# EAGLE design tally_box (EAGLE 6.6.0)
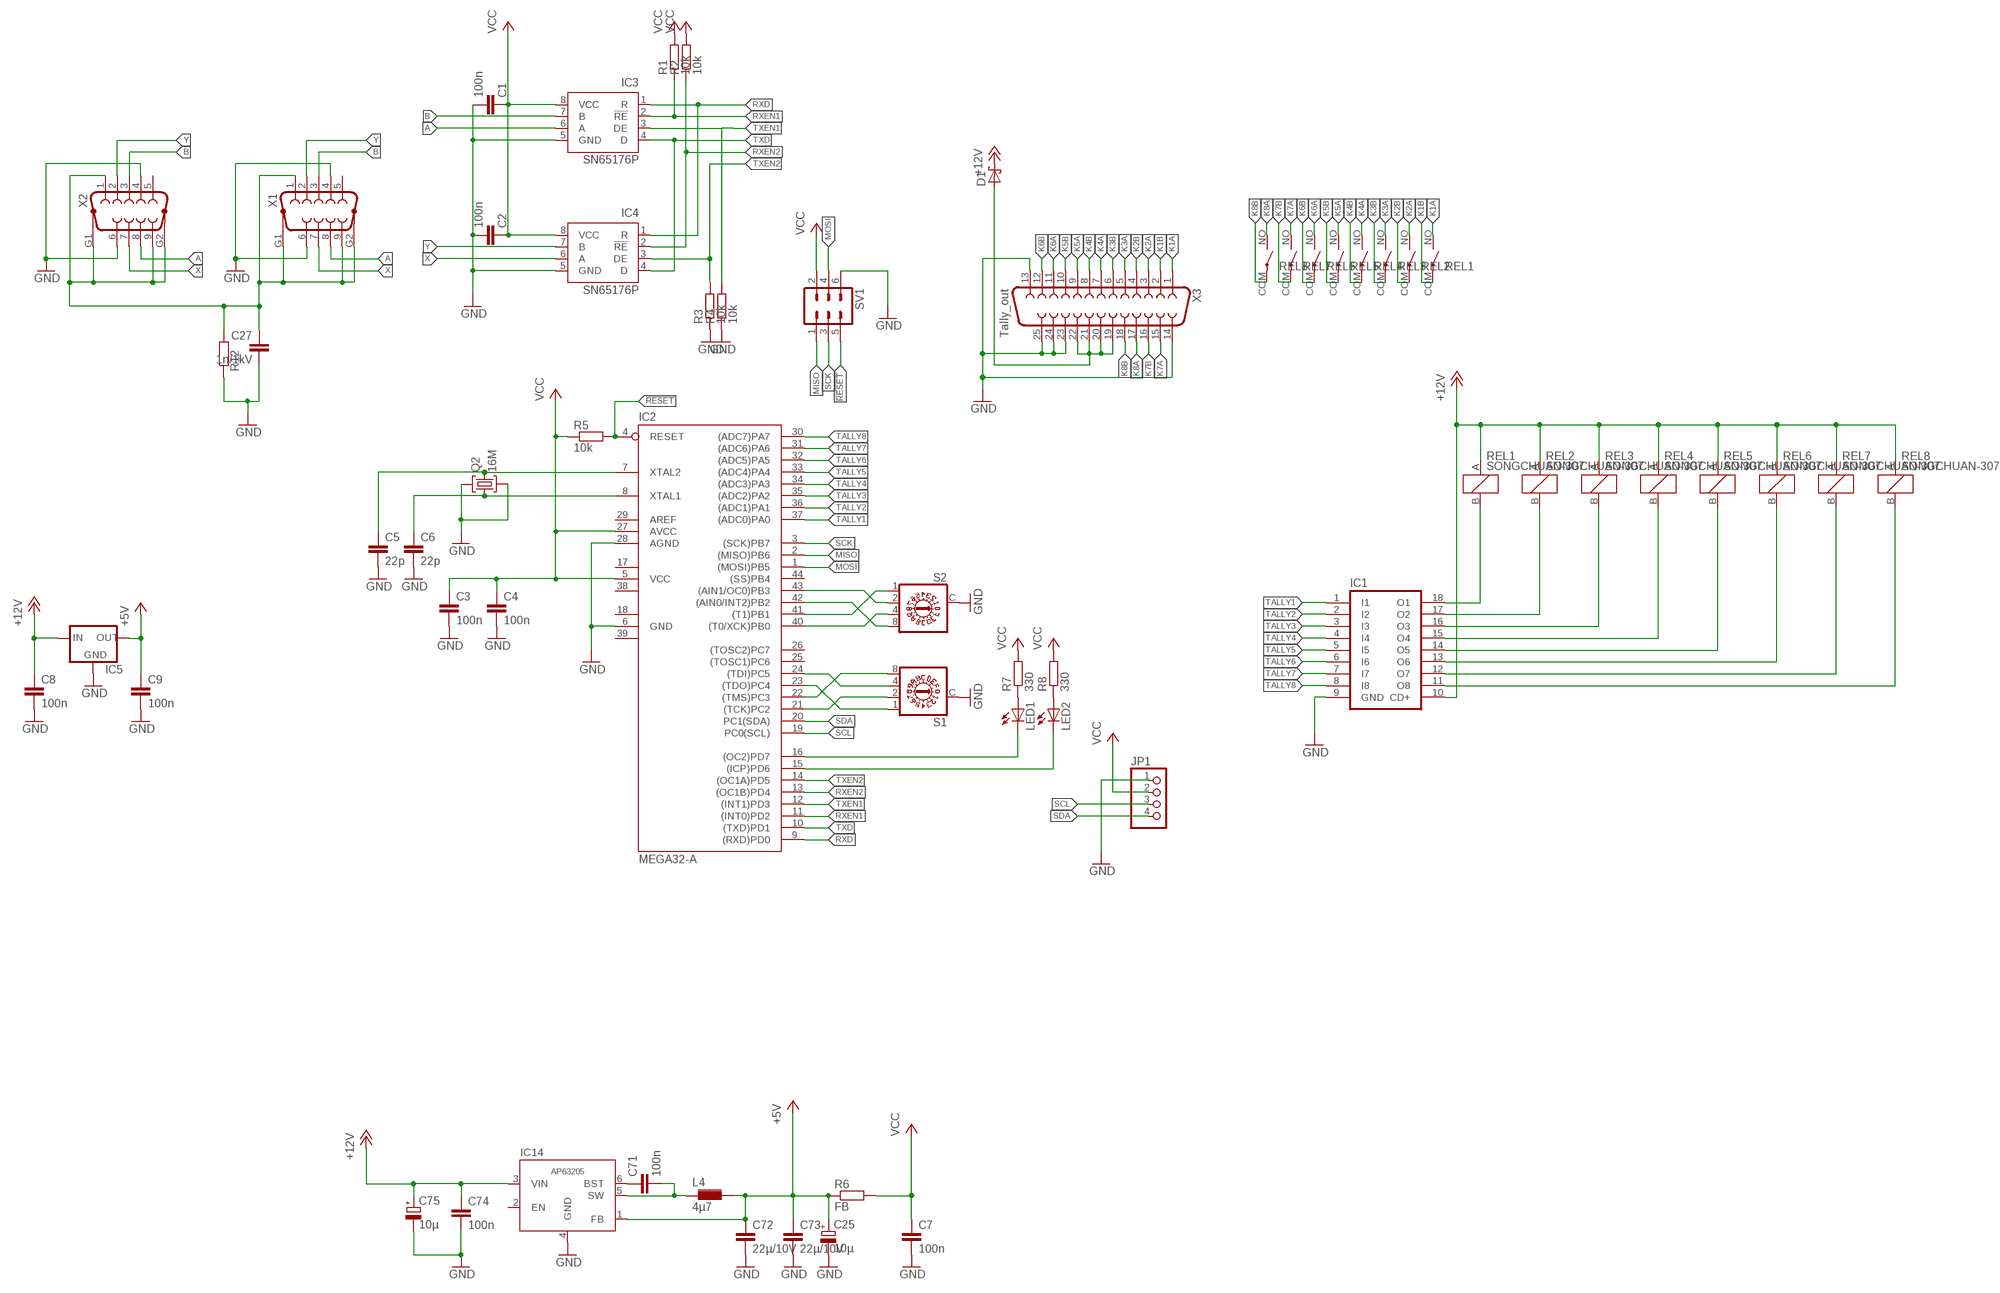
[diagram p0: schematic, sheet 1]

## Parts
C1  100n  C-EUC0603  [C0603]
C2  100n  C-EUC0603  [C0603]
C3  100n  C-EUC0603  [C0603]
C4  100n  C-EUC0603  [C0603]
C5  22p  C-EUC0603  [C0603]
C6  22p  C-EUC0603  [C0603]
C7  100n  C-EUC0603  [C0603]
C8  100n  C-EUC0805  [C0805]
C9  100n  C-EUC0805  [C0805]
C25  10µ  CPOL-EUC  [PANASONIC_C]
C27  1n/1kV  C-EUC1206  [C1206]
C71  100n  C-EUC0805  [C0805]
C72  22µ/10V  C-EUC0805  [C0805]
C73  22µ/10V  C-EUC0805  [C0805]
C74  100n  C-EUC0805  [C0805]
C75  10µ  CPOL-EUD  [PANASONIC_D]
D1  SCHOTTKY-DIODESMD  [SMB]
IC1  ULN2803A  [DIL18]
IC2  MEGA32-A  [TQFP44]
IC3  SN65176P  [DIL08]
IC4  SN65176P  [DIL08]
IC5  78XXS  [78XXS]
IC14  AP63205  AP6320X  [SOT23-6L]
JP1  PINHD-1X4  [1X04]
L4  4µ7  L-TYA4020  [TYA4020]
LED1  LED-TOPLED  [P-LCC-2]
LED2  LED-TOPLED  [P-LCC-2]
Q2  16M  CRYSTAL_SHIELDEDMJ  [MJ]
R1  10k  R-EU_R0603  [R0603]
R2  10k  R-EU_R0603  [R0603]
R3  10k  R-EU_R0603  [R0603]
R4  10k  R-EU_R0603  [R0603]
R5  10k  R-EU_R0603  [R0603]
R6  FB  R-EU_R0805  [R0805]
R7  330  R-EU_R0603  [R0603]
R8  330  R-EU_R0603  [R0603]
R12  R-EU_R0603  [R0603]
REL1  SONGCHUAN-307  [SONCHUAN-307]
REL2  SONGCHUAN-307  [SONCHUAN-307]
REL3  SONGCHUAN-307  [SONCHUAN-307]
REL4  SONGCHUAN-307  [SONCHUAN-307]
REL5  SONGCHUAN-307  [SONCHUAN-307]
REL6  SONGCHUAN-307  [SONCHUAN-307]
REL7  SONGCHUAN-307  [SONCHUAN-307]
REL8  SONGCHUAN-307  [SONCHUAN-307]
S1  A1353HEX  [A1353HEX]
S2  A1353HEX  [A1353HEX]
SV1  ML6  [ML6]
X1  F09HP  [F09HP]
X2  F09HP  [F09HP]
X3  Tally_out  F25HP  [F25HP]

## Nets
!RESET!: IC2.4(RESET) R5.2 SV1.5
+5V: C9.1 C25.+ C72.1 C73.1 IC5.OUT IC14.1(FB) L4.2 R6.1
+12V: C8.1 C74.1 C75.+ D1.C IC1.10(CD+) IC5.IN IC14.3(VIN) REL1.A(+) REL2.A(+) REL3.A(+) REL4.A(+) REL5.A(+) REL6.A(+) REL7.A(+) REL8.A(+)
A: IC3.6(A) X1.8 X2.8
B: IC3.7(B) X1.3 X2.3
GND: C1.2 C2.2 C3.2 C4.2 C5.2 C6.2 C7.2 C8.2 C9.2 C25.- C27.2 C72.2 C73.2 C74.2 C75.- IC1.9(GND) IC2.6(GND) IC2.28(AGND) IC3.5(GND) IC4.5(GND) IC5.GND IC14.4(GND) JP1.1 Q2.2(G1) Q2.4(G2) R3.1 R4.1 R12.1 S1.C S2.C SV1.6 X1.4 X1.6 X2.4 X2.6 X3.13 X3.14 X3.23 X3.24 X3.25
K1A: REL1.NO(S) X3.1
K1B: REL1.COM(P) X3.2
K2A: REL2.NO(S) X3.3
K2B: REL2.COM(P) X3.4
K3A: REL3.NO(S) X3.5
K3B: REL3.COM(P) X3.6
K4A: REL4.NO(S) X3.7
K4B: REL4.COM(P) X3.8
K5A: REL5.NO(S) X3.9
K5B: REL5.COM(P) X3.10
K6A: REL6.NO(S) X3.11
K6B: REL6.COM(P) X3.12
K7A: REL7.NO(S) X3.15
K7B: REL7.COM(P) X3.16
K8A: REL8.NO(S) X3.17
K8B: REL8.COM(P) X3.18
MISO: IC2.2((MISO)PB6) SV1.1
MOSI: IC2.1((MOSI)PB5) SV1.4
N$1: IC1.18(O1) REL1.B(-)
N$2: IC1.17(O2) REL2.B(-)
N$3: IC1.16(O3) REL3.B(-)
N$4: IC1.15(O4) REL4.B(-)
N$5: IC2.23((TDO)PC4) S1.1
N$6: IC2.21((TCK)PC2) S1.2
N$7: IC2.22((TMS)PC3) S1.8
N$8: IC2.24((TDI)PC5) S1.4
N$9: IC1.14(O5) REL5.B(-)
N$10: IC1.13(O6) REL6.B(-)
N$11: IC1.12(O7) REL7.B(-)
N$12: IC1.11(O8) REL8.B(-)
N$13: IC2.43((AIN1/OC0)PB3) S2.2
N$14: D1.A X3.19 X3.20 X3.21 X3.22
N$15: IC2.42((AIN0/INT2)PB2) S2.8
N$16: IC2.41((T1)PB1) S2.1
N$17: IC2.40((T0/XCK)PB0) S2.4
N$18: C5.1 IC2.7(XTAL2) Q2.3
N$19: C6.1 IC2.8(XTAL1) Q2.1
N$20: IC2.16((OC2)PD7) LED1.C
N$21: IC2.15((ICP)PD6) LED2.C
N$22: LED1.A R7.1
N$23: LED2.A R8.1
N$87: C71.1 IC14.6(BST)
RXD: IC2.9((RXD)PD0) IC3.1(R) IC4.1(R)
RXEN1: IC2.11((INT0)PD2) IC3.2(!RE) R1.1
RXEN2: IC2.13((OC1B)PD4) IC4.2(!RE) R2.1
SCK: IC2.3((SCK)PB7) SV1.3
SCL: IC2.19(PC0(SCL)) JP1.3
SDA: IC2.20(PC1(SDA)) JP1.4
TALLY1: IC1.1(I1) IC2.37((ADC0)PA0)
TALLY2: IC1.2(I2) IC2.36((ADC1)PA1)
TALLY3: IC1.3(I3) IC2.35((ADC2)PA2)
TALLY4: IC1.4(I4) IC2.34((ADC3)PA3)
TALLY5: IC1.5(I5) IC2.33((ADC4)PA4)
TALLY6: IC1.6(I6) IC2.32((ADC5)PA5)
TALLY7: IC1.7(I7) IC2.31((ADC6)PA6)
TALLY8: IC1.8(I8) IC2.30((ADC7)PA7)
TXD: IC2.10((TXD)PD1) IC3.4(D) IC4.4(D)
TXEN1: IC2.12((INT1)PD3) IC3.3(DE) R4.2
TXEN2: IC2.14((OC1A)PD5) IC4.3(DE) R3.2
VCC: C1.1 C2.1 C3.1 C4.1 C7.1 IC2.5(VCC) IC2.27(AVCC) IC3.8(VCC) IC4.8(VCC) JP1.2 R1.2 R2.2 R5.1 R6.2 R7.2 R8.2 SV1.2
VSW_5V: C71.2 IC14.5(SW) L4.1
X: IC4.6(A) X1.7 X2.7
XGND [fgnd]: C27.1 R12.2 X1.1 X1.9 X1.G1 X1.G2 X2.1 X2.9 X2.G1 X2.G2
Y: IC4.7(B) X1.2 X2.2
Unconnected: IC2.25((TOSC1)PC6) IC2.26((TOSC2)PC7) IC2.44((SS)PB4) IC14.2(EN) X1.5 X2.5

## Power pins joined to a net without a drawn wire
AREF: IC2.29(AREF)
GND1: IC2.18(GND1)
GND2: IC2.39(GND2)
VCC1: IC2.17(VCC1)
VCC2: IC2.38(VCC2)

## Library data of the parts
C1-C9 C27 C71-C74 = rcl:C-EU: CAPACITOR, European symbol
C25 C75 = rcl:CPOL-EU: POLARIZED CAPACITOR, European symbol
D1 = diode:SCHOTTKY-DIODE: Schottky Diode
IC1 = uln-udn:ULN2803A: DRIVER ARRAY
IC2 = avr-1:MEGA32: MICROCONTROLLER 32 Kbytes FLASH 2 Kbytes SRAM 1 Kbytes EEPROM USART 8-channel 10 bit ADC
IC3 IC4 = texas:SN65176: DIFFERENTIAL BUS TRANSCEIVER Source: http://focus.ti.com .. sn65176b.pdf
IC5 = v-reg:78XXS: VOLTAGE REGULATOR
IC14 = schaltregler:AP6320X
JP1 = pinhead:PINHD-1X4: PIN HEADER
L4 = myinductors:L
LED1 LED2 = myleds:LED: LED rectangle, 5.7 x 3.2 mm
Q2 = mycrystals:CRYSTAL_SHIELDED
R1-R8 R12 = rcl:R-EU_: RESISTOR, European symbol
REL1-REL8 = myrelais:SONGCHUAN-307
S1 S2 = switch-dil:A1353HEX: DIL/CODE SWITCH
SV1 = con-harting-ml:ML6: HARTING
X1 X2 = con-subd:F09HP: SUB-D
X3 = con-subd:F25: SUB-D

## Net classes
3 fgnd: clearance 0.5 mm to class 0

## Board
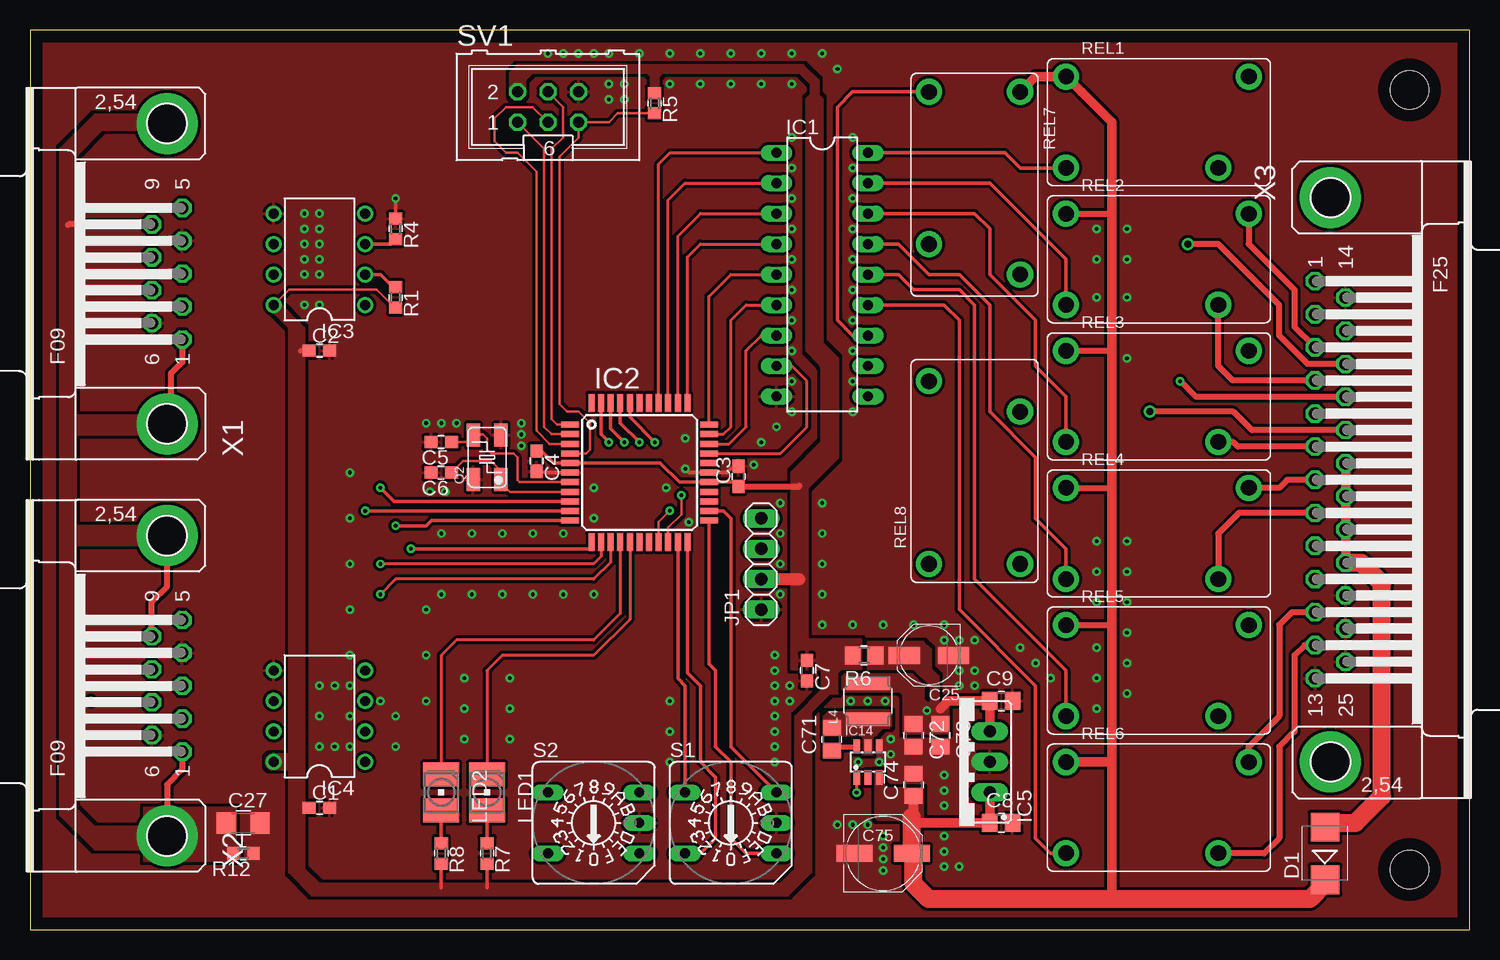
[diagram p1: board, top side]
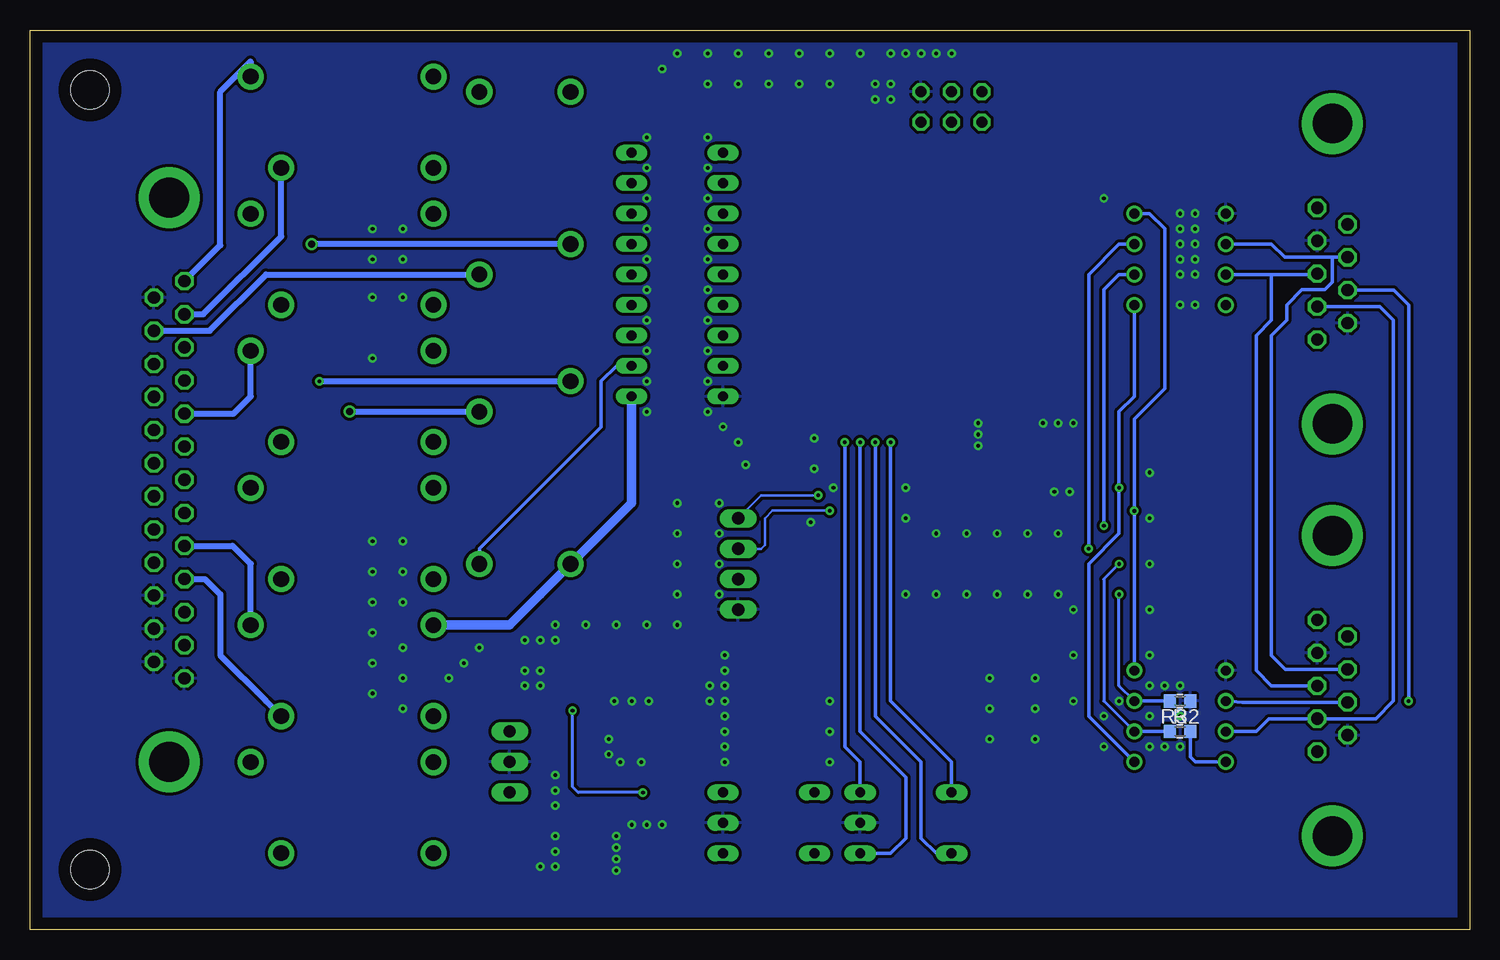
[diagram p2: board, bottom side, seen from below]

Size 120 x 75 mm. Coordinates in mm from the lower left corner, seen from the top.
Outline: 0,0 120,0 120,75 0,75 0,0
Copper layers (1*16): Top 0.035mm / dielectric 1.5mm / Bottom 0.035mm
Design rules "default *": minimum track width 0.2mm, minimum drill 0.3mm, track to track 8mil, track to pad 8mil, pad to pad 8mil, via to via 8mil, smd to smd 8mil, copper to edge 40mil, drill to drill 8mil, minimum pad ring 10mil, minimum via ring 8mil, stop-mask expansion 4mil, vias tented up to drill 0mil, thermal gap 10mil
Holes 3.2 mm at 115,5 115,70

### Footprints (pad centres in the part's own frame; a part is rotated, then mirrored left to right if it is on the bottom)
C0603 = smd 1.1 x 1: 1 -0.85,0; 2 0.85,0
C0805 = smd 1.3 x 1.5: 1 -0.95,0; 2 0.95,0
PANASONIC_C = smd 2.6 x 1.4: + 2.05,0; - -2.05,0
C1206 = smd 1.6 x 1.8: 1 -1.4,0; 2 1.4,0
PANASONIC_D = smd 3 x 1.4: + 2.4,0; - -2.4,0
SMB = smd 2.4 x 2.4: A 2.2,0; C -2.2,0
DIL18 = drill 0.813 long: 1 -10.16,-3.81; 2 -7.62,-3.81; 3 -5.08,-3.81; 4 -2.54,-3.81; 5 0,-3.81; 6 2.54,-3.81; 7 5.08,-3.81; 8 7.62,-3.81; 9 10.16,-3.81; 10 10.16,3.81; 11 7.62,3.81; 12 5.08,3.81; 13 2.54,3.81; 14 0,3.81; 15 -2.54,3.81; 16 -5.08,3.81; 17 -7.62,3.81; 18 -10.16,3.81
TQFP44 = smd 1.5 x 0.5: 1 -5.8,4; 2 -5.8,3.2; 3 -5.8,2.4; 4 -5.8,1.6; 5 -5.8,0.8; 6 -5.8,0; 7 -5.8,-0.8; 8 -5.8,-1.6; 9 -5.8,-2.4; 10 -5.8,-3.2; 11 -5.8,-4; 23 5.8,-4; 24 5.8,-3.2; 25 5.8,-2.4; 26 5.8,-1.6; 27 5.8,-0.8; 28 5.8,0; 29 5.8,0.8; 30 5.8,1.6; 31 5.8,2.4; 32 5.8,3.2; 33 5.8,4 | smd 0.5 x 1.5: 12 -4,-5.8; 13 -3.2,-5.8; 14 -2.4,-5.8; 15 -1.6,-5.8; 16 -0.8,-5.8; 17 0,-5.8; 18 0.8,-5.8; 19 1.6,-5.8; 20 2.4,-5.8; 21 3.2,-5.8; 22 4,-5.8; 34 4,5.8; 35 3.2,5.8; 36 2.4,5.8; 37 1.6,5.8; 38 0.8,5.8; 39 0,5.8; 40 -0.8,5.8; 41 -1.6,5.8; 42 -2.4,5.8; 43 -3.2,5.8; 44 -4,5.8
DIL08 = drill 0.813 pad 1.27: 1 -3.81,-3.81; 2 -1.27,-3.81; 3 1.27,-3.81; 4 3.81,-3.81; 5 3.81,3.81; 6 1.27,3.81; 7 -1.27,3.81; 8 -3.81,3.81
78XXS = drill 1.016 long: GND 0,-2.54; IN -2.54,-2.54; OUT 2.54,-2.54
SOT23-6L = smd 0.55 x 1.2: 1 -0.95,-1.3; 2 0,-1.3; 3 0.95,-1.3; 4 0.95,1.3; 5 0,1.3; 6 -0.95,1.3
1X04 = drill 1.016 long: 1 -3.81,0; 2 -1.27,0; 3 1.27,0; 4 3.81,0
TYA4020 = smd 1.1 x 3.7: 1 -1.5,0; 2 1.5,0
P-LCC-2 = smd 3 x 2: A 0,1.5; C 0,-1.5
MJ = smd 1.9 x 1.1: 1 -1.85,-1.15; 2 1.85,-1.15; 3 1.85,1.15; 4 -1.85,1.15
R0603 = smd 1 x 1.1: 1 -0.85,0; 2 0.85,0
R0805 = smd 1.3 x 1.5: 1 -0.95,0; 2 0.95,0
SONCHUAN-307 = drill 1.3 pad 2.184: A -7.62,3.8; B -7.62,-3.8; COM 5.08,-3.8; NO 7.62,3.8
A1353HEX = drill 0.813 long: 1 3.81,-2.54; 2 -3.81,2.54; 4 3.81,2.54; 8 -3.81,-2.54; C 3.81,0
ML6 = drill 0.914 octagon: 1 -2.54,-1.27; 2 -2.54,1.27; 3 0,-1.27; 4 0,1.27; 5 2.54,-1.27; 6 2.54,1.27
F09HP = drill 1.016 octagon: 1 -5.486,-1.27; 2 -2.743,-1.27; 3 0,-1.27; 4 2.743,-1.27; 5 5.486,-1.27; 6 -4.115,1.27; 7 -1.372,1.27; 8 1.372,1.27; 9 4.115,1.27 | drill 3.302 pad 5.08: G1 -12.522,0; G2 12.522,0
F25HP = drill 1.016 octagon: 1 -16.561,-1.27; 2 -13.792,-1.27; 3 -11.049,-1.27; 4 -8.28,-1.27; 5 -5.512,-1.27; 6 -2.769,-1.27; 7 0,-1.27; 8 2.769,-1.27; 9 5.512,-1.27; 10 8.28,-1.27; 11 11.049,-1.27; 12 13.792,-1.27; 13 16.561,-1.27; 14 -15.189,1.27; 15 -12.421,1.27; 16 -9.652,1.27; 17 -6.909,1.27; 18 -4.14,1.27; 19 -1.372,1.27; 20 1.372,1.27; 21 4.14,1.27; 22 6.909,1.27; 23 9.652,1.27; 24 12.421,1.27; 25 15.189,1.27 | drill 3.302 pad 5.08: G1 -23.52,0; G2 23.52,0

### Placement (x,y rotation side)
C1  24.13,10.16 0 top
C2  24.13,48.26 0 top
C3  59.05,37.78 90 top
C4  42.23,39.05 270 top
C5  34.29,40.64 180 top
C6  34.29,38.1 180 top
C7  64.77,21.59 270 top
C8  80.96,8.89 0 top
C9  80.96,19.05 0 top
C25  74.93,22.86 180 top
C27  17.78,8.89 0 top
C71  66.83,15.88 90 top
C72  73.66,16.19 270 top
C73  75.88,16.19 270 top
C74  73.66,12.06 90 top
C75  71.12,6.35 0 top
D1  107.95,6.35 90 top
IC1  66.04,54.61 270 top
IC2  50.8,38.1 0 top
IC3  24.13,55.88 90 top
IC4  24.13,17.78 90 top
IC5  77.47,13.97 90 top
IC14  69.85,13.97 0 top
JP1  60.96,30.48 90 top
L4  69.85,19.05 90 top
LED1  38.1,11.43 180 top
LED2  34.29,11.43 180 top
Q2  38.1,39.37 90 top
R1  30.48,52.7 270 top
R2  24.13,16.51 0 bottom
R3  24.13,19.05 180 bottom
R4  30.48,58.42 270 top
R5  52.07,68.9 270 top
R6  69.53,22.86 180 top
R7  38.1,6.35 270 top
R8  34.29,6.35 270 top
R12  17.78,6.35 180 top
REL1  93.98,67.31 0 top
REL2  93.98,55.88 0 top
REL3  93.98,44.45 0 top
REL4  93.98,33.02 0 top
REL5  93.98,21.59 0 top
REL6  93.98,10.16 0 top
REL7  78.74,62.23 270 top
REL8  78.74,38.1 90 top
S1  58.42,8.89 0 top
S2  46.99,8.89 0 top
SV1  43.18,68.58 0 top
X1  11.43,54.68 90 top
X2  11.43,20.32 90 top
X3  108.4,37.5 270 top

### Tracks (layer width: path | path; a pad name or v marks a point on that pad's centre or on a via)
!RESET!
  Top 0.2: IC2.4 46.37,39.7 46.67,40.01 46.67,42.23 45.72,43.18 44.77,43.18 44.13,43.81 44.13,64.45 45.72,66.04 SV1.5 48.26,67.31 49,68.05 R5.2
+5V  (via drill 0.3)
  Top 0.25: IC14.1 v68.9,11.43
  Top 0.8: IC5.OUT C9.1 76.52,19.05 75.88,18.41
  Bottom 0.25: v68.9,11.43 74.3,11.43 74.77,11.91 v74.77,18.26
  pour Top (isolate 0.25, no thermals): 72.87,16.35 72.87,19.53 72.55,19.84 67.94,19.84 67.79,20 67.79,21.11 67.94,21.27 73.5,21.27 74.45,20.32 74.45,19.21 74.77,18.89 76.36,18.89 76.52,18.73 76.52,16.35
  pour Top (isolate 0.25, rank 3, no thermals): 75.09,18.73 75.09,20.32 73.66,21.75 69.85,21.75 69.85,23.97 74.45,23.97 75.09,23.34 75.09,21.75 75.72,21.11 75.72,18.73
+12V
  Top 0.5: REL3.A 90.17,48.26 | REL2.A 90.16,59.68 90.17,59.69 | REL1.A | REL5.A 90.16,25.39 90.17,25.4 | REL4.A 90.16,36.82 90.17,36.83
  Top 0.8: 90.17,13.96 90.17,25.4 90.17,36.83 90.17,48.26 90.17,59.69 90.17,67.31 87.64,69.84 REL1.A | REL7.A 83.81,71.12 REL1.A | REL6.A 90.17,13.96 | 90.17,13.96 90.17,2.54 | IC5.IN C8.1 73.66,8.89 C74.1
  Top 1.5: D1.C 107.95,3.81 106.68,2.54 90.17,2.54 74.93,2.54 73.66,3.81 73.66,6.21 C75.+ 73.52,9.35 73.5,9.37
  Bottom 0.8: REL5.A 80.02,25.39 77.48,27.93 REL8.A 69.85,35.57 IC1.10
  pour Top (isolate 0.25, rank 2, no thermals): 70.48,13.18 70.48,9.37 70.64,9.21 74.45,9.21 74.45,11.75 71.44,11.75 71.12,12.06 71.12,13.18
A
  Bottom 0.3: X1.8 11.43,56.05 | 11.43,56.05 15.41,56.05 16.51,57.15 IC3.6 | X2.8 15.34,21.69 16.51,22.86 16.51,49.53 15.24,50.8 15.24,52.07 13.97,53.34 12.06,53.34 11.43,53.98 11.43,56.05
B
  Bottom 0.3: IC3.7 16.51,54.61 | 16.51,54.61 12.77,54.61 X1.3 | X2.3 16.51,20.32 17.78,21.59 17.78,49.53 16.51,50.8 16.51,54.61
GND  (via drill 0.3)
  Top 0.3: R4.1 v30.48,60.96 | IC2.6 42.97,38.1 C4.2 | C3.2 58.84,38.42 58.42,38.42 58.1,38.1 IC2.28 54.93,38.1 v54.61,38.42
  other vias: 69.06,13.97 70.8,13.97 71.28,19.05 69.85,19.05 68.42,19.05 71.12,7.78 71.12,6.83 71.12,5.87 71.12,4.92 76.2,7.78 76.2,10.32 76.2,11.59 76.2,12.86 76.2,6.51 76.2,5.24 77.47,5.24 67.31,8.73 68.58,8.73 69.85,8.73 60.33,38.73 33.34,36.51 34.61,36.51 33.02,42.23 34.29,42.23 35.56,42.23 40.96,42.23 40.96,41.27 40.96,40.32 63.34,19.05 62.07,19.05 62.07,20.32 63.34,20.32 62.07,21.59 62.07,22.86 62.07,17.78 62.07,16.51 62.07,15.24 62.07,13.97 22.86,54.61 24.13,54.61 22.86,52.07 24.13,52.07 22.86,55.88 22.86,57.15 22.86,58.42 22.86,59.69 24.13,59.69 24.13,58.42 24.13,57.15 24.13,55.88 43.18,73.03 44.45,73.03 45.72,73.03 46.99,73.03 48.26,73.03 50.8,73.03 53.34,73.03 55.88,73.03 58.42,73.03 60.96,73.03 63.5,73.03 66.04,73.03 67.31,71.75 63.5,70.48 60.96,70.48 58.42,70.48 55.88,70.48 53.34,70.48 49.53,70.48 48.26,70.48 48.26,69.22 49.53,69.22 63.5,50.8 68.58,53.34 63.5,53.34 63.5,55.88 68.58,55.88 63.5,58.42 68.58,58.42 63.5,60.96 68.58,60.96 63.5,63.5 68.58,63.5 63.5,66.04 68.58,66.04 68.58,50.8 68.58,48.26 68.58,45.72 63.5,48.26 68.58,43.18 63.5,43.18 63.5,45.72 62.23,41.91 60.96,40.64 66.04,35.56 66.04,33.02 66.04,30.48 66.04,27.94 62.55,30.48 62.55,33.02 62.55,35.56 62.55,27.94 66.04,25.4 68.58,25.4 71.12,25.4 73.66,25.4 76.2,25.4 76.2,24.13 77.47,24.13 78.74,24.13 78.74,21.59 77.47,21.59 77.47,20.32 78.74,20.32 82.55,23.5 83.82,22.23 85.09,20.95 88.9,23.5 88.9,20.95 88.9,18.41 88.9,27.3 88.9,29.84 88.9,32.38 91.44,32.38 91.44,29.84 91.44,27.3 91.44,24.77 91.44,22.23 91.44,19.68 91.44,47.62 91.44,52.7 88.9,52.7 88.9,55.88 91.44,55.88 91.44,58.42 88.9,58.42 26.67,20.32 26.67,17.78 26.67,15.24 25.4,20.32 24.13,20.32 24.13,17.78 24.13,15.24 25.4,15.24 30.48,17.78 29.21,19.05 30.48,15.24 33.02,26.67 33.02,22.86 33.02,19.05 26.67,22.86 26.67,26.67 26.67,30.48 26.67,34.29 26.67,38.1 34.29,33.02 36.83,33.02 39.37,33.02 41.91,33.02 44.45,33.02 34.29,27.94 36.83,27.94 39.37,27.94 41.91,27.94 44.45,27.94 46.99,27.94 36.2,15.88 36.2,18.41 36.2,20.95 40.01,20.95 40.01,18.41 40.01,15.88 53.34,19.05 53.34,16.51 53.34,13.97 46.99,36.83 46.99,34.29 54.61,40.96 53.02,36.83 54.93,33.97 71.75,15.88 71.75,14.61
  pour Bottom (isolate 0.25, rank 5): 0,0 120,0 120,75 0,75
  pour Top (isolate 0.25, rank 4, no thermals): 66.04,1.27 66.04,25.4 78.74,25.4 78.74,1.27
  pour Top (isolate 0.25, rank 5): 0,0 120,0 120,75 0,75
  pour Top (isolate 0.25, rank 4, no thermals): 25.4,11.11 25.4,9.21 26.04,9.21 26.04,11.11
  pour Top (isolate 0.25, rank 4, no thermals): 25.4,49.21 25.4,47.31 26.04,47.31 26.04,49.21
  pour Top (isolate 0.25, rank 4, no thermals): 17.78,11.11 17.78,5.4 20.95,5.4 20.95,11.11
K1A
  Bottom 0.5: X3.1 104.14,57.05 104.14,69.85 101.61,72.38 REL1.NO
K1B
  Bottom 0.5: REL1.COM 99.06,57.78 105.55,51.29 X3.2
K2A
  Top 0.5: X3.3 105.41,50.27 105.41,53.34 101.6,57.15 REL2.NO
K2B
  Top 0.5: X3.4 100.27,45.78 99.06,46.99 REL2.COM
K3A
  Bottom 0.5: X3.5 103.04,43.01 101.6,44.45 REL3.NO
K3B
  Top 0.5: X3.6 100.7,40.27 100.33,40.64 REL3.COM
K4A
  Top 0.5: X3.7 104.81,37.5 104.14,36.83 REL4.NO
K4B
  Top 0.5: X3.8 100.77,34.73 99.06,33.02 REL4.COM
K5A
  Bottom 0.5: REL5.NO 101.6,30.48 103.11,31.99 X3.9
K5B
  Bottom 0.5: X3.10 105.42,29.22 104.14,27.94 104.14,22.86 100.33,19.05 REL5.COM
K6A
  Top 0.5: X3.11 105.19,26.45 104.14,25.4 104.14,17.78 101.6,15.24 REL6.NO
K6B
  Top 0.5: X3.12 106.26,23.71 105.41,22.86 105.41,16.51 104.14,15.24 104.14,7.62 102.87,6.35 REL6.COM
K7A
  Bottom 0.5: X3.15 105.02,49.92 100.33,54.61 REL7.NO
K7B  (via drill 0.6)
  Top 0.5: X3.16 106.52,47.15 104.14,49.53 104.14,52.07 99.06,57.15 v96.52,57.15
  Bottom 0.5: REL7.COM v96.52,57.15
K8A  (via drill 0.3)
  Top 0.5: X3.17 97.2,44.41 v95.89,45.72
  Bottom 0.5: v95.89,45.72 REL8.NO
K8B  (via drill 0.6)
  Top 0.5: X3.18 101.87,41.64 100.33,43.18 v93.34,43.18
  Bottom 0.5: v93.34,43.18 REL8.COM
MISO
  Top 0.2: IC2.2 43.47,41.3 42.86,41.91 42.86,65.09 SV1.1
MOSI
  Top 0.2: IC2.1 43.94,42.1 43.5,42.55 43.5,65.09 44.45,66.04 44.45,68.58 SV1.4
N$1
  Top 0.3: IC1.18 81.28,64.77 82.55,63.5 REL1.B
N$2
  Top 0.3: REL2.B 86.36,55.88 80.01,62.23 IC1.17
N$3
  Top 0.3: IC1.16 78.74,59.69 80.01,58.42 80.01,54.61 83.82,50.8 83.82,46.99 86.36,44.45 REL3.B
N$4
  Top 0.3: REL4.B 86.36,31.75 83.82,34.29 83.82,39.37 80.01,43.18 80.01,52.07 77.47,54.61 74.93,54.61 72.39,57.15 IC1.15
N$5
  Top 0.3: IC2.23 56.6,22.14 57.15,21.59 57.15,15.24 58.42,13.97 58.42,7.62 59.69,6.35 S1.1
N$6
  Top 0.3: IC2.21 54,20.93 54.61,20.32 S1.2
N$7
  Top 0.3: IC2.22 54.8,21.4 55.88,20.32 55.88,13.97 57.15,12.7 57.15,7.62 55.88,6.35 S1.8
N$8
  Top 0.3: IC2.24 57.81,34.9 58.42,34.29 58.42,15.24 S1.4
N$9
  Top 0.3: REL5.B 86.36,21.6 83.82,24.14 83.82,24.13 78.74,29.21 78.74,52.07 77.47,53.34 73.66,53.34 72.39,54.61 IC1.14
N$10
  Top 0.3: IC1.13 76.2,52.07 77.47,50.8 77.47,26.67 83.82,20.32 83.82,7.62 85.08,6.36 REL6.B
N$11
  Top 0.3: IC1.12 68.58,49.53 67.31,50.8 67.31,68.58 68.58,69.85 REL7.B
N$12
  Bottom 0.3: REL8.B 82.54,31.76 72.39,41.91 72.39,45.72 71.12,46.99 IC1.11
N$13  (via drill 0.3)
  Top 0.3: IC2.43 47.6,41.3 v48.26,40.64
  Bottom 0.3: v48.26,40.64 48.26,19.05 43.18,13.97 S2.2
N$14
  Top 0.8: X3.22 X3.21 X3.20 X3.19
  Top 1.5: D1.A 107.95,8.89 110.49,8.89 112.69,11.09 112.69,28.84 110.94,30.59 X3.22
N$15  (via drill 0.3)
  Top 0.3: IC2.42 48.4,41.77 v49.53,40.64
  Bottom 0.3: v49.53,40.64 49.53,17.78 45.72,13.97 45.72,7.62 44.45,6.35 S2.8
N$16  (via drill 0.3)
  Top 0.3: IC2.41 49.2,42.24 v50.8,40.64
  Bottom 0.3: v50.8,40.64 50.8,16.51 46.99,12.7 46.99,7.62 48.26,6.35 S2.1
N$17  (via drill 0.3)
  Top 0.3: IC2.40 50,42.71 v52.07,40.64
  Bottom 0.3: v52.07,40.64 52.07,15.24 50.8,13.97 S2.4
N$18
  Top 0.2: C5.1 37.15,40.64 37.15,41.02 Q2.3 37.01,41.27 37.78,41.27 38.1,40.96 38.1,40.01 38.42,39.69 40.32,39.69 40.64,39.37 40.64,37.47 40.8,37.3 IC2.7
N$19
  Top 0.2: IC2.8 40.02,36.5 39.69,36.83 39.69,37.08 Q2.1 39.25,38.22 38.42,39.05 36.09,39.05 C6.1
N$20
  Top 0.25: IC2.16 50,25.87 46.99,22.86 39.37,22.86 38.1,21.59 LED1.C
N$21
  Top 0.25: IC2.15 49.2,26.34 46.99,24.13 35.56,24.13 34.29,22.86 LED2.C
N$22
  Top 0.3: R7.1 LED1.A
N$23
  Top 0.3: R8.1 LED2.A
N$87
  Top 0.4: C71.1 66.83,15.24 68.9,15.24 IC14.6
RXD  (via drill 0.3)
  Top 0.3: IC2.9 30.34,35.7 v29.21,36.83
  Bottom 0.3: IC4.1 31.75,17.78 31.75,30.48 29.21,33.02 v29.21,36.83 29.21,43.18 27.94,44.45 IC3.1
RXEN1  (via drill 0.3)
  Top 0.3: v30.48,33.66 33.02,33.66 33.47,34.1 IC2.11 | R1.1 30.27,53.55 29.21,54.61 IC3.2
  Bottom 0.3: IC3.2 29.21,54.61 30.48,53.34 v30.48,33.66
RXEN2  (via drill 0.3)
  Top 0.25: IC2.13 47.6,31.09 46.99,30.48 v29.21,30.48
  Bottom 0.25: v29.21,30.48 30.48,29.21 30.48,19.05 IC4.2
  Bottom 0.3: R2.1 IC4.2
SCK
  Top 0.2: IC2.3 43.32,40.5 42.23,41.59 42.23,63.18 40.64,64.77 39.69,64.77 38.73,65.72 38.73,67.63 39.69,68.58 41.91,68.58 SV1.3
SCL  (via drill 0.3)
  Top 0.2: IC2.19 52.4,33.98 v53.34,34.92
  Bottom 0.2: JP1.3 59.05,31.75 58.74,32.07 58.74,34.29 58.1,34.92 v53.34,34.92
SDA  (via drill 0.3)
  Top 0.2: IC2.20 53.2,33.52 54.29,34.61 v54.29,36.2
  Bottom 0.2: v54.29,36.2 59.05,36.2 JP1.4
TALLY1
  Top 0.25: IC2.37 52.4,63.83 53.34,64.77 IC1.1
TALLY2
  Top 0.25: IC2.36 53.2,60.82 54.61,62.23 IC1.2
TALLY3
  Top 0.25: IC2.35 54,57.81 55.88,59.69 IC1.3
TALLY4
  Top 0.25: IC2.34 54.8,56.07 55.88,57.15 IC1.4
TALLY5
  Top 0.25: IC2.33 56.6,52.79 58.42,54.61 IC1.5
TALLY6
  Top 0.25: IC2.32 57.81,41.3 58.42,41.91 58.42,50.8 59.69,52.07 IC1.6
TALLY7
  Top 0.25: IC2.31 58.28,40.5 59.69,41.91 59.69,48.26 60.96,49.53 IC1.7
TALLY8
  Top 0.25: IC2.30 62.56,39.7 64.77,41.91 64.77,45.72 63.5,46.99 IC1.8
TXD  (via drill 0.3)
  Top 0.3: v27.94,34.9 IC2.10
  Bottom 0.3: IC4.4 v27.94,34.9 27.94,34.92 27.94,36.83 27.94,42.55 25.4,45.09 25.4,58.42 26.67,59.69 IC3.4
TXEN1  (via drill 0.3)
  Top 0.3: R4.2 30.06,57.15 IC3.3 | IC2.12 46.8,31.75 v31.75,31.75
  Bottom 0.3: IC3.3 29.21,57.15 31.75,54.61 v31.75,31.75
TXEN2  (via drill 0.3)
  Top 0.25: IC2.14 48.4,30.62 46.99,29.21 30.48,29.21 v29.21,27.94
  Bottom 0.25: IC4.3 29.21,20.32 v29.21,27.94
  Bottom 0.3: R3.2 IC4.3
VCC
  Top 0.2: R1.2 30.38,51.85 28.89,53.34 21.59,53.34 IC3.8
  Top 0.3: C4.1 42.65,39.9 43.65,38.9 IC2.5 52.54,38.9 54.14,37.3 IC2.27 58.69,37.3 C3.1 | R8.2 34.29,3.49 | R7.2 38.1,3.49
  Top 0.4: C2.1 22.54,48.26
  Top 0.5: C3.1 64.08,36.93 64.14,36.99
  Top 1: JP1.2 64.14,29.21
  Bottom 0.3: R2.2 23.28,14.39 22.86,13.97 IC4.8
  pour Top (isolate 0.25, rank 3, no thermals): 69.22,24.13 69.22,21.75 66.99,21.75 66.99,24.13
  pour Top (isolate 0.25, rank 2): 67.31,21.75 63.5,21.75 63.5,38.1 66.04,40.64 66.04,46.58 arc45 65.75,47.28 64.77,48.26 64.77,69.22 65.41,69.85 66.04,69.22 66.04,48.9 67.31,47.62 67.31,39.37 64.77,36.83 64.77,24.13 67.31,24.13
  pour Top (isolate 0.25, rank 3, no thermals): 66.04,21.91 66.04,20 63.82,17.78 63.82,5.08 62.55,3.81 24.13,3.81 22.86,5.08 22.86,50.16 20.6,52.42 arc90 20.04,52.42 19.97,52.35 arc90 19.97,51.79 21.59,50.16 21.59,14.61 20.29,14.61 arc90 19.68,14.01 19.68,13.94 arc90 20.29,13.34 21.59,13.34 21.59,4.76 23.5,2.86 63.18,2.86 65.09,4.76 65.09,18.1 66.67,19.68 67.31,19.68 67.63,20 67.63,21.91
  pour Top (isolate 0.25, rank 4, no thermals): 40.01,71.44 40.01,69.81 arc90 40.6,69.22 40.67,69.22 arc90 41.27,69.81 41.27,70.8 41.91,71.44 51.44,71.44 51.75,71.12 51.75,69.85 52.39,69.85 52.39,71.12 52.7,71.44 64.14,71.44 65.09,70.48 65.09,68.9 65.72,68.9 65.72,70.8 64.45,72.07 40.64,72.07
VSW_5V
  pour Top (isolate 0.25, no thermals): 69.53,14.61 70.17,14.61 70.17,15.88 71.12,16.83 71.6,16.83 71.75,16.99 71.75,18.1 71.6,18.26 68.1,18.26 67.94,18.1 66.52,18.1 66.2,17.78 66.2,16.19 69.22,16.19 69.53,15.88
X  (via drill 0.3)
  Top 0.3: X2.7 10.16,19.05 v5.08,19.05
  Bottom 0.3: X2.7 18.95,18.95 IC4.6 | X1.7 6.32,53.31 5.08,52.07 v5.08,19.05
XGND
  Top 0.5: X1.9 3.23,58.8 3.17,58.74 | X1.1 12.7,47.31 11.75,46.35 11.75,42.48 X1.G1 | X2.9 10.16,27.3 11.43,28.57 X2.G2 | X2.1 12.7,13.34 11.43,12.06 X2.G1
  pour Top (isolate 0.25, rank 2, no thermals): 10.16,10.16 17.14,10.16 17.14,7.3 17.46,6.99 17.46,6.03 17.14,5.71 9.53,5.71 9.53,10.16 9.84,10.16
  pour Top (isolate 0.25, rank 4, no thermals): 11.43,8.57 5.4,8.57 3.81,10.16 3.81,32.07 12.7,32.07 12.7,33.66 3.81,33.66 3.81,41.27 12.06,41.27 12.06,42.86 3.81,42.86 3.81,64.45 6.03,66.67 12.7,66.67 12.7,67.94 5.4,67.94 2.54,65.09 2.54,9.53 5.4,6.67 11.43,6.67
Y
  Bottom 0.3: IC4.7 17.78,16.51 16.71,17.58 X2.2 7.82,17.58 6.35,19.05 6.35,50.8 7.49,51.94 X1.2